# EAGLE design Summation synth and line (EAGLE 9.6.2)
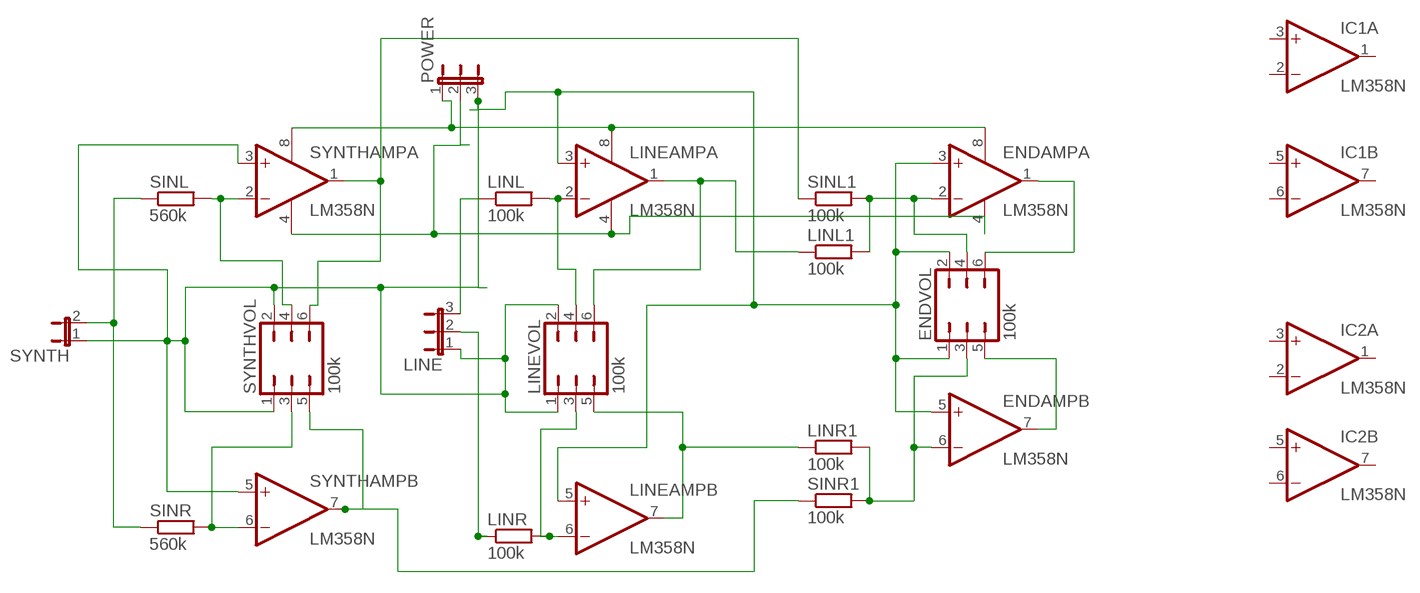
[diagram p0: schematic, sheet 1]

## Parts
ENDAMP  LM358N  [DIL08]
ENDVOL  100k  JP3Q  [JP3Q]
IC1  LM358N  [DIL08]
IC2  LM358N  [DIL08]
LINE  JP2E  [JP2]
LINEAMP  LM358N  [DIL08]
LINEVOL  100k  JP3Q  [JP3Q]
LINL  100k  R-EU_0207/7  [0207/7]
LINL1  100k  R-EU_0207/7  [0207/7]
LINR  100k  R-EU_0207/7  [0207/7]
LINR1  100k  R-EU_0207/7  [0207/7]
POWER  JP2E  [JP2]
SINL  560k  R-EU_0207/7  [0207/7]
SINL1  100k  R-EU_0207/7  [0207/7]
SINR  560k  R-EU_0207/7  [0207/7]
SINR1  100k  R-EU_0207/7  [0207/7]
SYNTH  JP1E  [JP1]
SYNTHAMP  LM358N  [DIL08]
SYNTHVOL  100k  JP3Q  [JP3Q]

## Nets
N$1: LINE.3 LINL.1
N$2: SINL.2 SYNTHAMP.2(A:-IN) SYNTHVOL.4
N$3: SINL.1 SINR.1 SYNTH.2
N$4: LINEAMP.2(A:-IN) LINEVOL.4 LINL.2
N$5: SINR.2 SYNTHAMP.6(B:-IN) SYNTHVOL.3
N$6: SINR1.1 SYNTHAMP.7(B:OUT) SYNTHVOL.5
N$7: LINE.2 LINR.1
N$8: LINEAMP.6(B:-IN) LINEVOL.3 LINR.2
N$10: LINEAMP.1(A:OUT) LINEVOL.6 LINL1.1
N$11: SINL1.1 SYNTHAMP.1(A:OUT) SYNTHVOL.6
N$12: ENDAMP.6(B:-IN) ENDVOL.3 LINR1.2 SINR1.2
N$13: LINEAMP.7(B:OUT) LINEVOL.5 LINR1.1
N$16: ENDAMP.8(P:V+) LINEAMP.8(P:V+) POWER.1 SYNTHAMP.8(P:V+)
N$17: ENDAMP.4(P:V-) LINEAMP.4(P:V-) POWER.2 SYNTHAMP.4(P:V-)
N$18: ENDAMP.3(A:+IN) ENDAMP.5(B:+IN) ENDVOL.1 ENDVOL.2 LINE.1 LINEAMP.3(A:+IN) LINEAMP.5(B:+IN) LINEVOL.1 LINEVOL.2 POWER.3 SYNTH.1 SYNTHAMP.3(A:+IN) SYNTHAMP.5(B:+IN) SYNTHVOL.1 SYNTHVOL.2
N$20: ENDAMP.2(A:-IN) ENDVOL.4 LINL1.2 SINL1.2
N$21: ENDAMP.1(A:OUT) ENDVOL.6
N$22: ENDAMP.7(B:OUT) ENDVOL.5
Unconnected: IC1.1(A:OUT) IC1.2(A:-IN) IC1.3(A:+IN) IC1.5(B:+IN) IC1.6(B:-IN) IC1.7(B:OUT) IC2.1(A:OUT) IC2.2(A:-IN) IC2.3(A:+IN) IC2.5(B:+IN) IC2.6(B:-IN) IC2.7(B:OUT)

## Power pins joined to a net without a drawn wire
V+: IC1.8(P:V+) IC2.8(P:V+)
V-: IC1.4(P:V-) IC2.4(P:V-)

## Library data of the parts
ENDAMP IC1 IC2 LINEAMP SYNTHAMP = linear:LM358: OP AMP also LM158; LM258; LM2904 Source: http://cache.national.com/ds/LM/LM158.pdf
ENDVOL LINEVOL SYNTHVOL = jumper:JP3Q: JUMPER
LINE POWER = jumper:JP2E: JUMPER
LINL LINL1 LINR LINR1 SINL SINL1 SINR SINR1 = rcl:R-EU_: RESISTOR, European symbol; SPICEPREFIX: R
SYNTH = jumper:JP1E: JUMPER

## Board
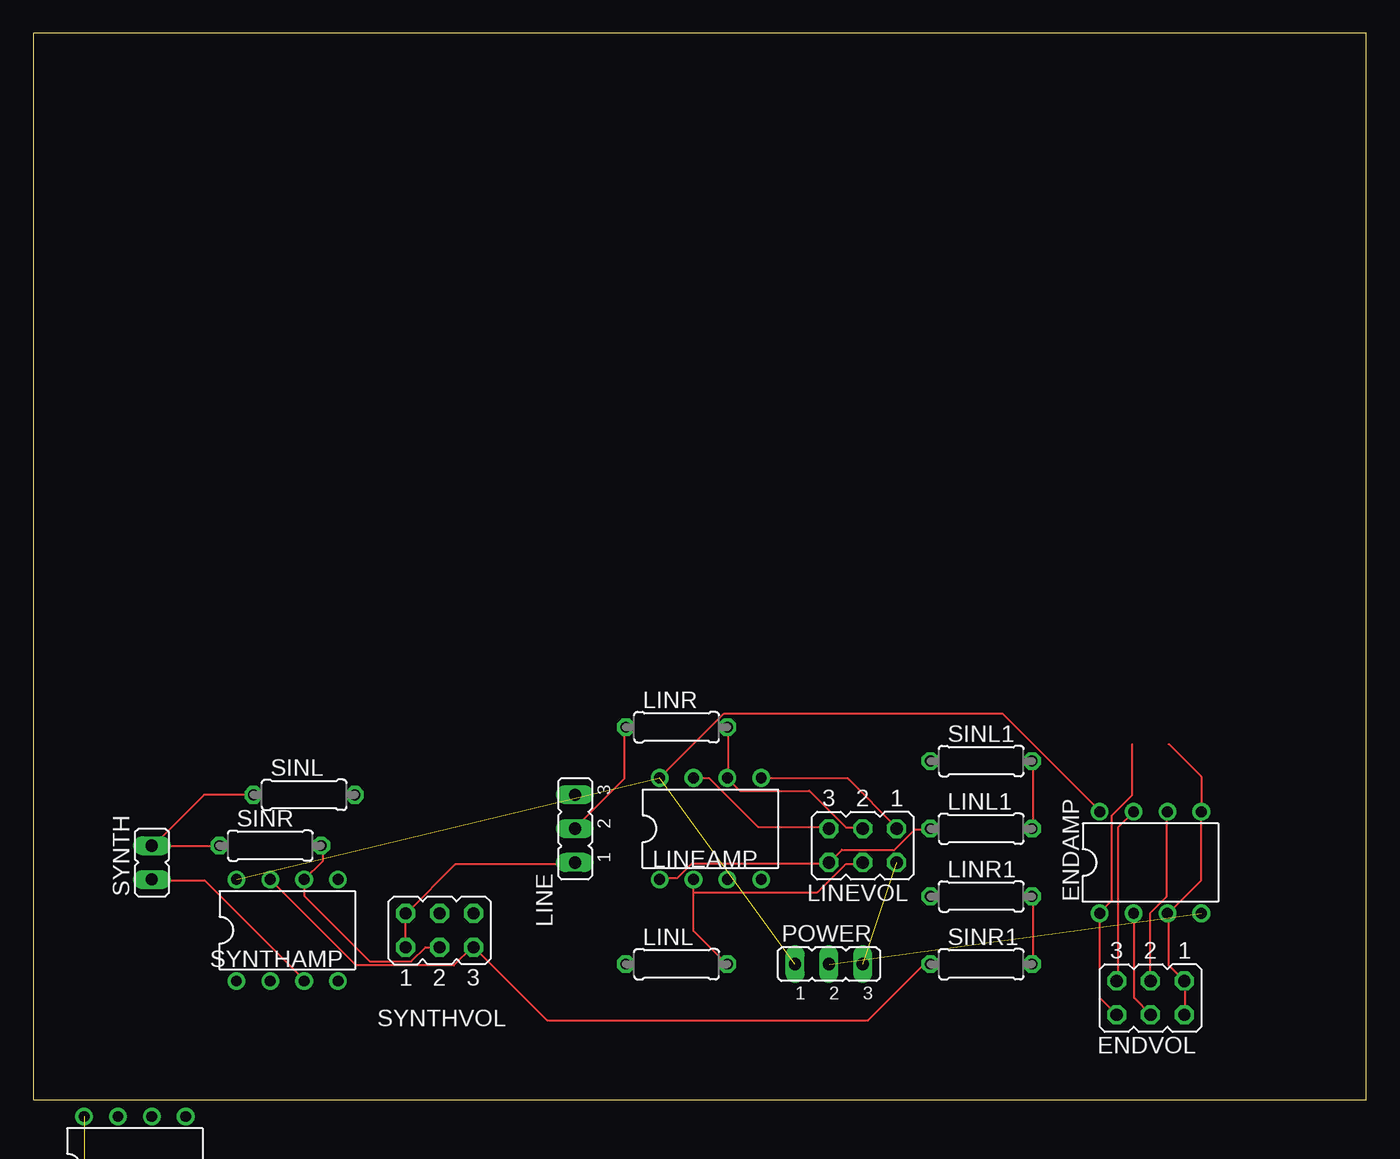
[diagram p1: board, top side]
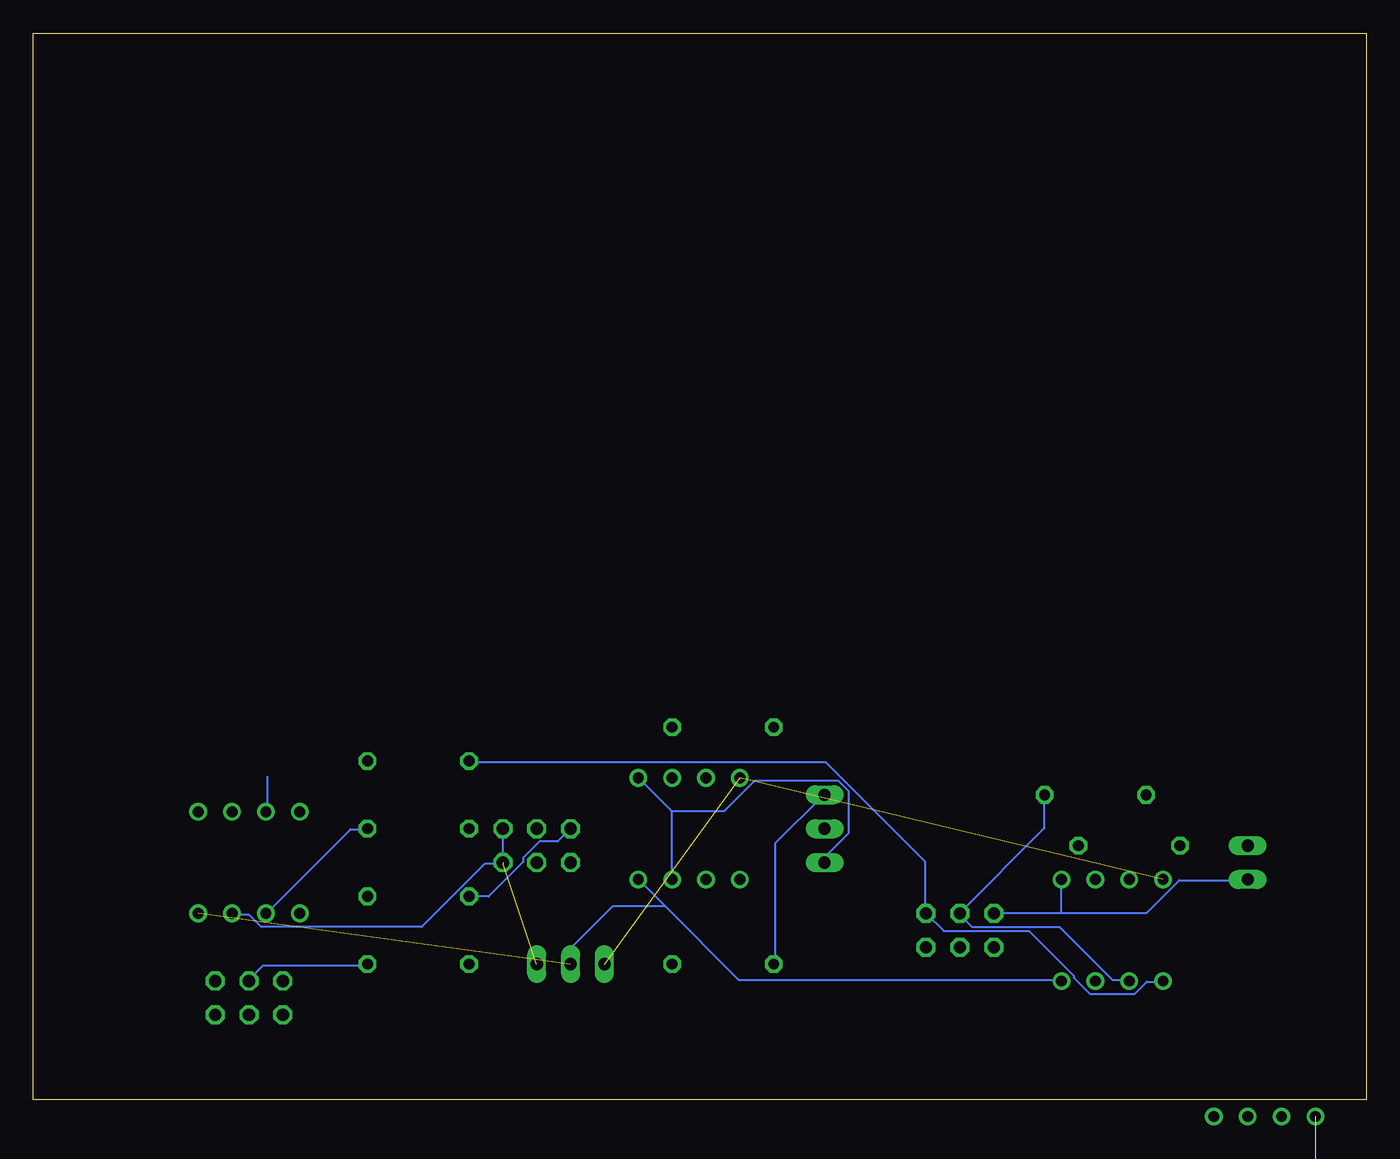
[diagram p2: board, bottom side, seen from below]

Size 100 x 80 mm. Coordinates in mm from the lower left corner, seen from the top.
Outline: 0,0 100,0 100,80 0,80 0,0
Copper layers (1*16): Top 0.035mm / dielectric 1.5mm / Bottom 0.035mm
Design rules "default": minimum track width 6mil, minimum drill 0.35mm, track to track 6mil, track to pad 6mil, pad to pad 6mil, via to via 6mil, smd to smd 6mil, copper to edge 40mil, drill to drill 6mil, minimum pad ring 10mil, minimum via ring 8mil, stop-mask expansion 4mil, vias tented up to drill 0mil, thermal gap 10mil

### Footprints (pad centres in the part's own frame; a part is rotated, then mirrored left to right if it is on the bottom)
DIL08 = drill 0.813 pad 1.27: 1 -3.81,-3.81; 2 -1.27,-3.81; 3 1.27,-3.81; 4 3.81,-3.81; 5 3.81,3.81; 6 1.27,3.81; 7 -1.27,3.81; 8 -3.81,3.81
JP3Q = drill 0.914 octagon: 1 -2.54,-1.27; 2 -2.54,1.27; 3 0,-1.27; 4 0,1.27; 5 2.54,-1.27; 6 2.54,1.27
JP2 = drill 0.914 long: 1 -2.54,0; 2 0,0; 3 2.54,0
0207/7 = drill 0.813 octagon: 1 -3.81,0; 2 3.81,0
JP1 = drill 0.914 long: 1 0,-1.27; 2 0,1.27

### Placement (x,y rotation side)
ENDAMP  83.82,17.78 0 top
ENDVOL  83.82,7.62 180 top
IC1  7.62,-5.08 0 top
IC2  7.62,-15.24 0 top  (outside the outline)
LINE  40.64,20.32 90 top
LINEAMP  50.8,20.32 0 top
LINEVOL  62.23,19.05 180 top
LINL  48.26,10.16 0 top
LINL1  71.12,20.32 0 top
LINR  48.26,27.94 0 top
LINR1  71.12,15.24 0 top
POWER  59.69,10.16 0 top
SINL  20.32,22.86 0 top
SINL1  71.12,25.4 0 top
SINR  17.78,19.05 0 top
SINR1  71.12,10.16 0 top
SYNTH  8.89,17.78 0 top
SYNTHAMP  19.05,12.7 0 top
SYNTHVOL  30.48,12.7 0 top

### Tracks (layer width: path | path; a pad name or v marks a point on that pad's centre or on a via)
N$1
  Bottom 0.152: LINL.1 44.35,10.21 44.35,19.2 40.69,22.86 LINE.3
N$2
  Bottom 0.152: SYNTHAMP.2 17.83,8.99 19.05,8.99 23.01,12.95 29.57,12.95 30.48,13.87 SYNTHVOL.4 30.48,14.02 24.13,20.37 SINL.2
N$3
  Top 0.152: SINL.1 12.8,22.86 8.99,19.05 | 8.99,19.05 SYNTH.2 | 8.99,19.05 SINR.1
N$4
  Top 0.152: 49.53,15.54 49.53,12.65 51.97,10.21 LINL.2 | 49.53,15.54 LINEAMP.2 | 49.53,15.54 58.83,15.54 60.96,17.68 62.18,17.68 LINEVOL.4
N$5
  Top 0.152: SINR.2 21.69,18.95 21.69,17.88 SYNTHAMP.6 20.32,15.29 25.25,10.36 28.35,10.36 29.41,11.43 SYNTHVOL.3
N$6
  Top 0.152: SINR1.1 67.21,10.06 66.75,10.06 62.64,5.94 38.56,5.94 33.07,11.43 SYNTHVOL.5 32.92,11.43 31.55,10.06 24.23,10.06 SYNTHAMP.7
N$7
  Top 0.152: LINR.1 44.35,27.89 44.35,24.08 40.69,20.42 LINE.2
N$8
  Top 0.152: LINR.2 52.12,27.89 52.12,24.23 LINEAMP.6 53.03,23.16 58.22,23.16 60.96,20.42 62.18,20.42 LINEVOL.3
N$10
  Top 0.152: LINEAMP.1 47.09,16.61 48.31,16.61 49.38,17.68 59.59,17.68 LINEVOL.6 60.66,18.75 64.62,18.75 66.14,20.27 67.21,20.27 LINL1.1
N$11
  Bottom 0.152: SYNTHAMP.1 15.24,8.84 16.46,8.84 17.37,7.92 20.73,7.92 21.95,9.14 21.95,9.3 25.3,12.65 31.7,12.65 SYNTHVOL.6 33.07,14.02 33.07,17.83 40.54,25.3 67.21,25.3 SINL1.1
N$12
  Top 0.152: SINR1.2 74.98,10.21 74.98,15.24 LINR1.2 | ENDVOL.3 83.82,14.02 85.04,15.24 85.04,21.49 ENDAMP.6
  Bottom 0.152: SINR1.2 74.98,10.06 82.75,10.06 83.82,8.99 ENDVOL.3
N$13
  Top 0.152: LINEAMP.7 49.53,24.08 50.75,24.08 54.41,20.42 59.59,20.42 LINEVOL.5
  Bottom 0.152: LINR1.1 65.84,15.24 63.25,17.83 63.25,18.14 62.03,19.36 60.66,19.36 LINEVOL.5
N$16  (2 unrouted)
  Top 0.152: LINEAMP.8 51.82,28.96 72.69,28.96 80.01,21.64 ENDAMP.8
N$17  (1 unrouted)
  Bottom 0.152: LINEAMP.4 52.58,14.48 | 52.58,14.48 47.09,8.99 22.86,8.99 SYNTHAMP.4 | 52.58,14.48 56.54,14.48 59.69,11.33 POWER.2 59.74,10.16 | 87.63,13.87 ENDAMP.4
N$18  (2 unrouted)
  Top 0.152: SYNTHVOL.1 27.89,11.43 27.89,13.87 SYNTHVOL.2 28.04,14.02 31.7,17.68 40.54,17.68 LINE.1 | 85.19,26.67 87.63,24.23 ENDAMP.5 87.63,16.46 85.19,14.02 ENDAMP.3 85.19,13.87 85.19,10.06 ENDVOL.1 86.41,8.84 86.41,6.4 ENDVOL.2 | LINEAMP.5 54.71,24.08 61.11,24.08 64.77,20.42 LINEVOL.1 | SYNTHAMP.3 20.32,8.99 12.85,16.46 8.99,16.46 SYNTH.1
  Bottom 0.152: 22.86,14.02 27.89,14.02 SYNTHVOL.2 | 22.86,14.02 16.46,14.02 14.02,16.46 8.99,16.46 SYNTH.1 | 52.12,21.64 52.12,16.61 LINEAMP.3 | LINEAMP.5 52.12,21.64 | LINEVOL.2 LINEVOL.1 | 64.77,17.68 66.14,17.68 70.87,12.95 82.91,12.95 83.82,13.87 85.04,13.87 ENDAMP.3 | 52.12,21.64 48.16,21.64 45.87,23.93 39.62,23.93 38.86,23.16 38.86,19.96 40.54,18.29 40.54,17.83 LINE.1 | 22.86,14.02 SYNTHAMP.5
N$20
  Top 0.152: LINL1.2 74.98,20.42 74.98,25.3 SINL1.2 | ENDAMP.2 82.6,13.87 82.6,7.62 83.82,6.4 ENDVOL.4
  Bottom 0.152: LINL1.2 74.98,20.27 76.2,20.27 82.45,14.02 ENDAMP.2
N$21
  Top 0.152: 82.45,26.67 82.45,22.86 80.92,21.34 80.92,14.94 80.01,14.02 ENDAMP.1 80.01,7.62 ENDVOL.6
N$22
  Top 0.152: ENDAMP.7 81.38,20.42 81.38,8.99 ENDVOL.5
  Bottom 0.152: 82.45,24.23 82.45,21.64 ENDAMP.7
V+  (1 unrouted)
V-  (1 unrouted)